# Altium schematic sheet Voltage_Regulator.SchDoc
size A; SheetNumber: 4; SheetTotal: 5
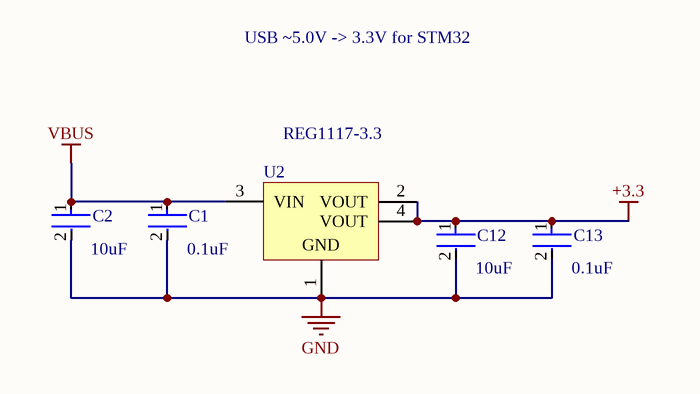
[diagram p0: Voltage_Regulator.SchDoc]

## Parts
C1  0.1uF  [CAPC0603(1608)100_L]
C2  10uF  [CAPC0603(1608)100_L]
C12  10uF  [CAPC0603(1608)100_L]
C13  0.1uF  [CAPC0603(1608)100_L]
U2  REG1117-3.3  [DCY0004A_M]

## Nets
+3.3: C12.1 C13.1 U2.2(VOUT) U2.4(VOUT)
GND: C1.2 C2.2 C12.2 C13.2 U2.1(GND)
VBUS: C1.1 C2.1 U2.3(VIN)

## Notes on the sheet
- USB ~5.0V -> 3.3V for STM32

## Library data of the parts
C1 C2 C12 C13 = CMP-001-00083-4: GENERIC CAPACITOR 0805 or 0603(1608)
U2 = CMP-019-00049-4: LDO Regulator Pos 3.3V 0.8A 4-Pin(3+Tab) SOT-223 Rail